# EAGLE design pepper-rev2b (EAGLE 9.4.2)
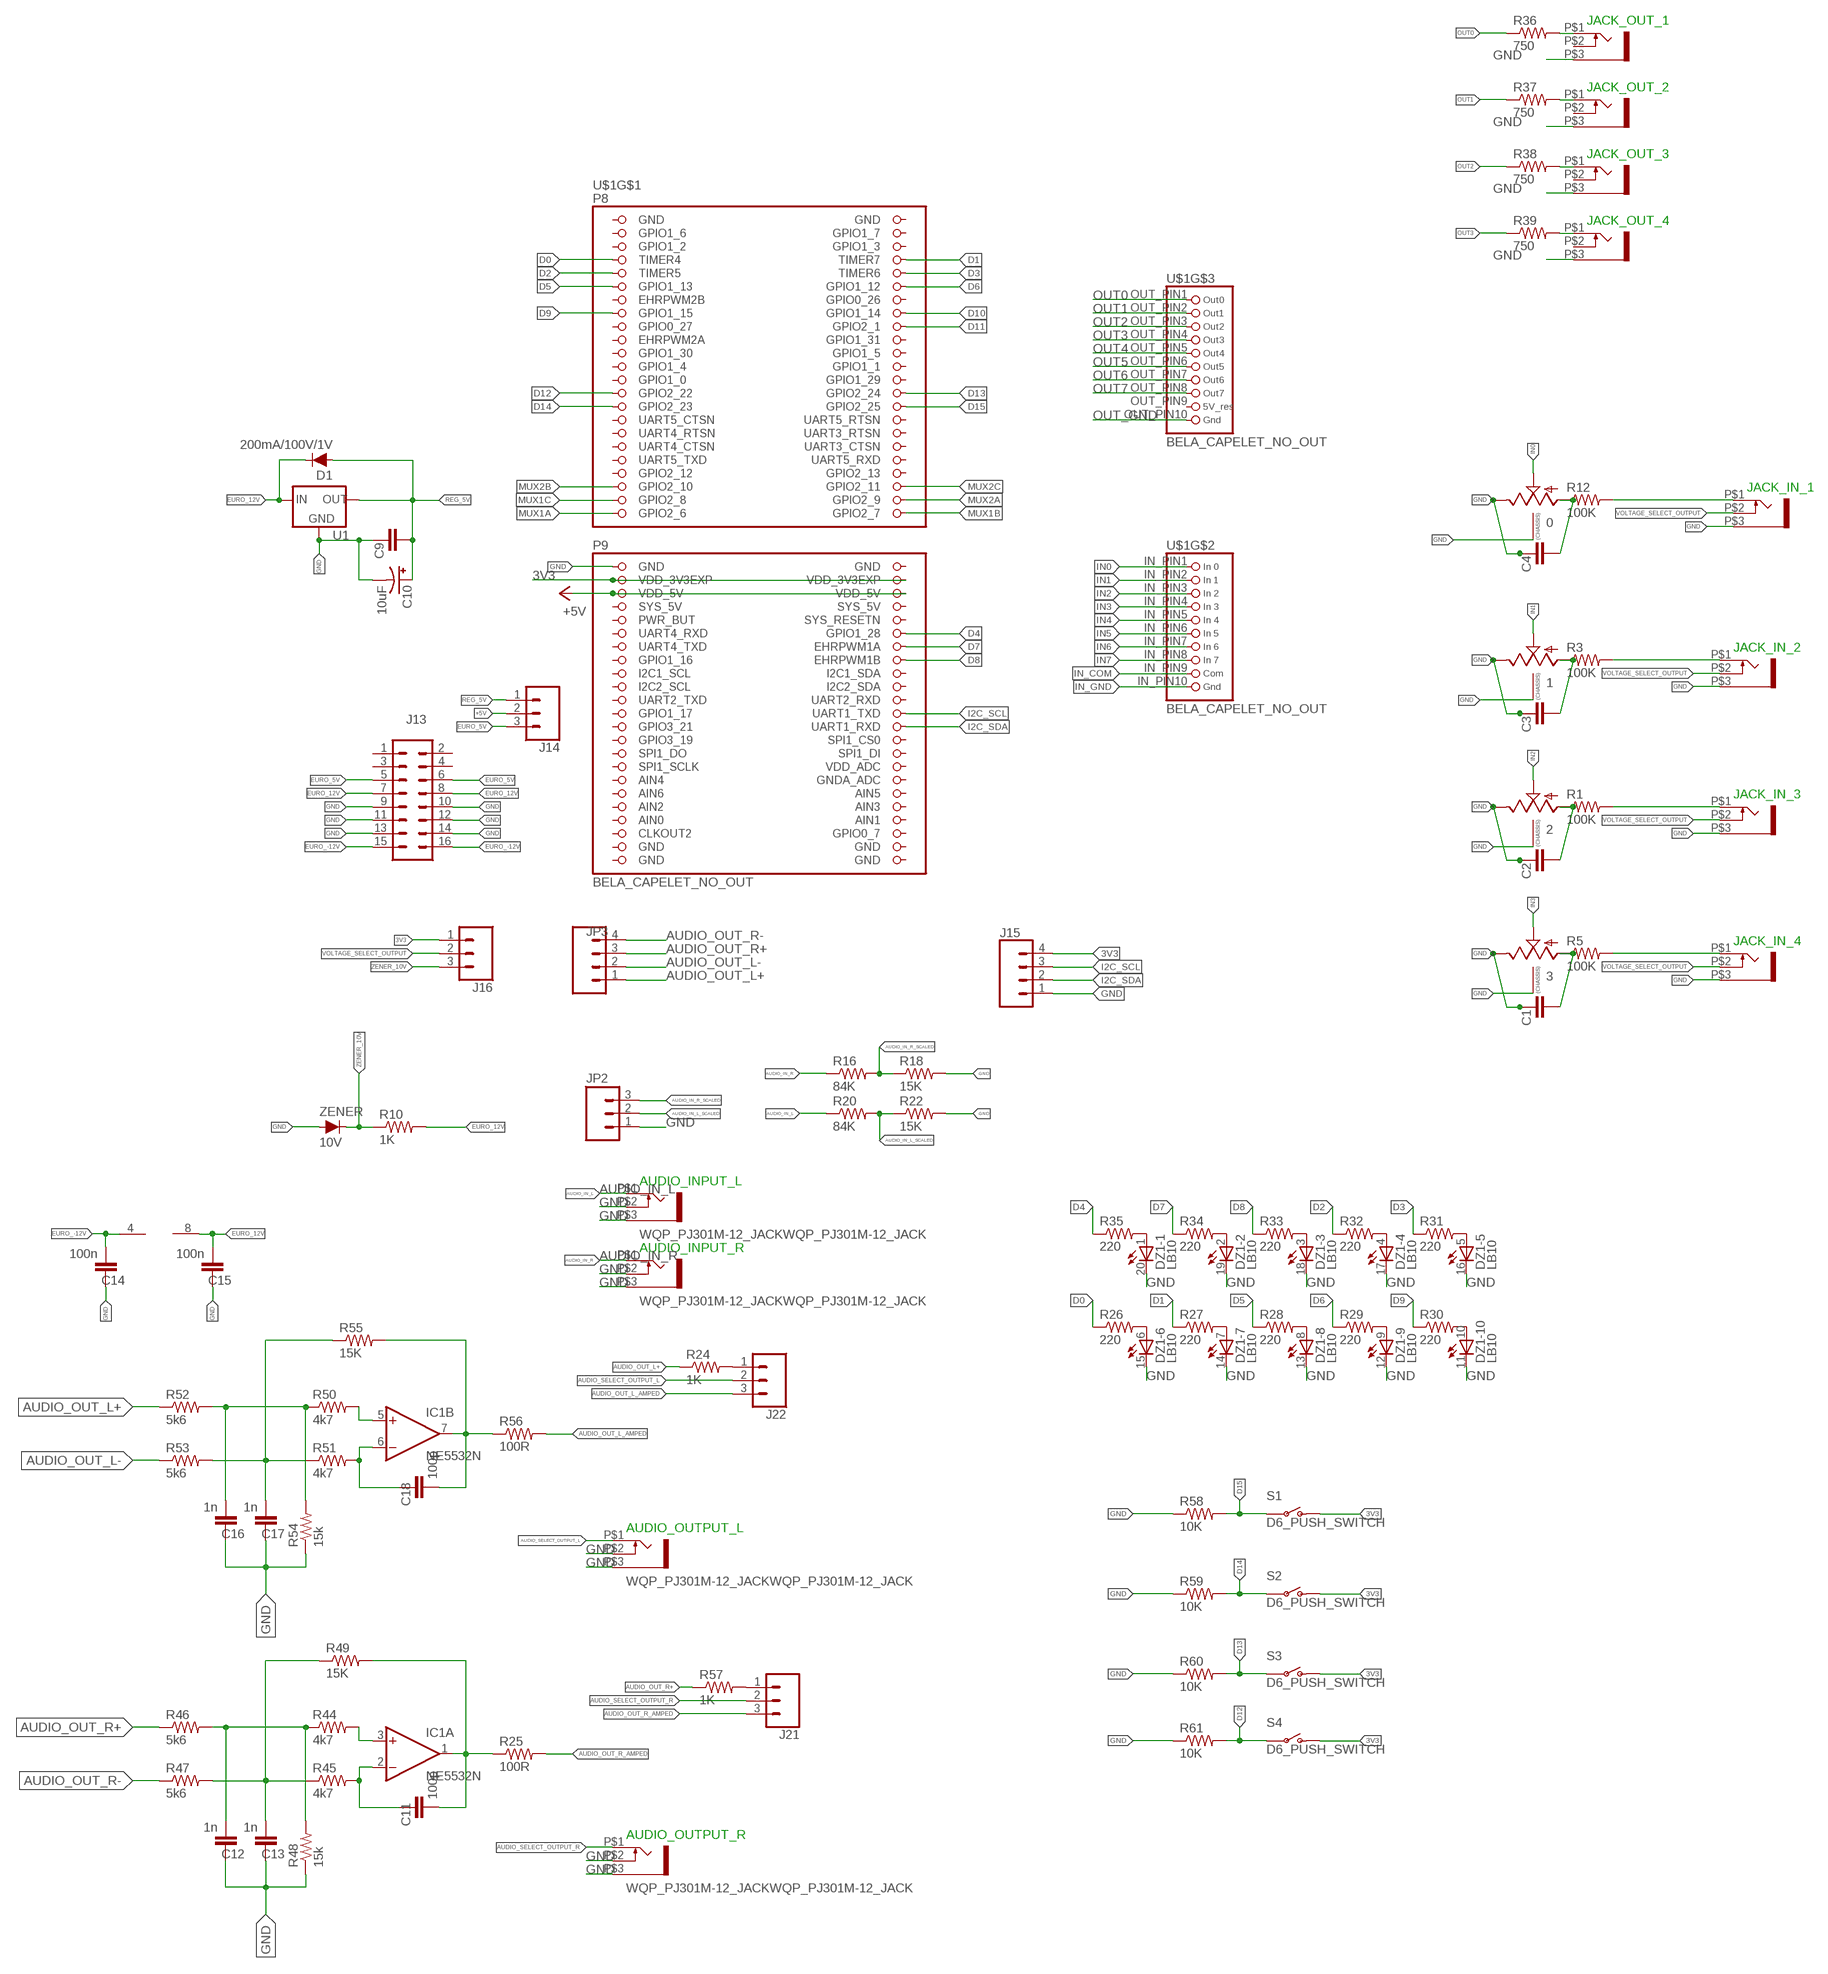
[diagram p0: schematic, sheet 1, part 1 of 2]
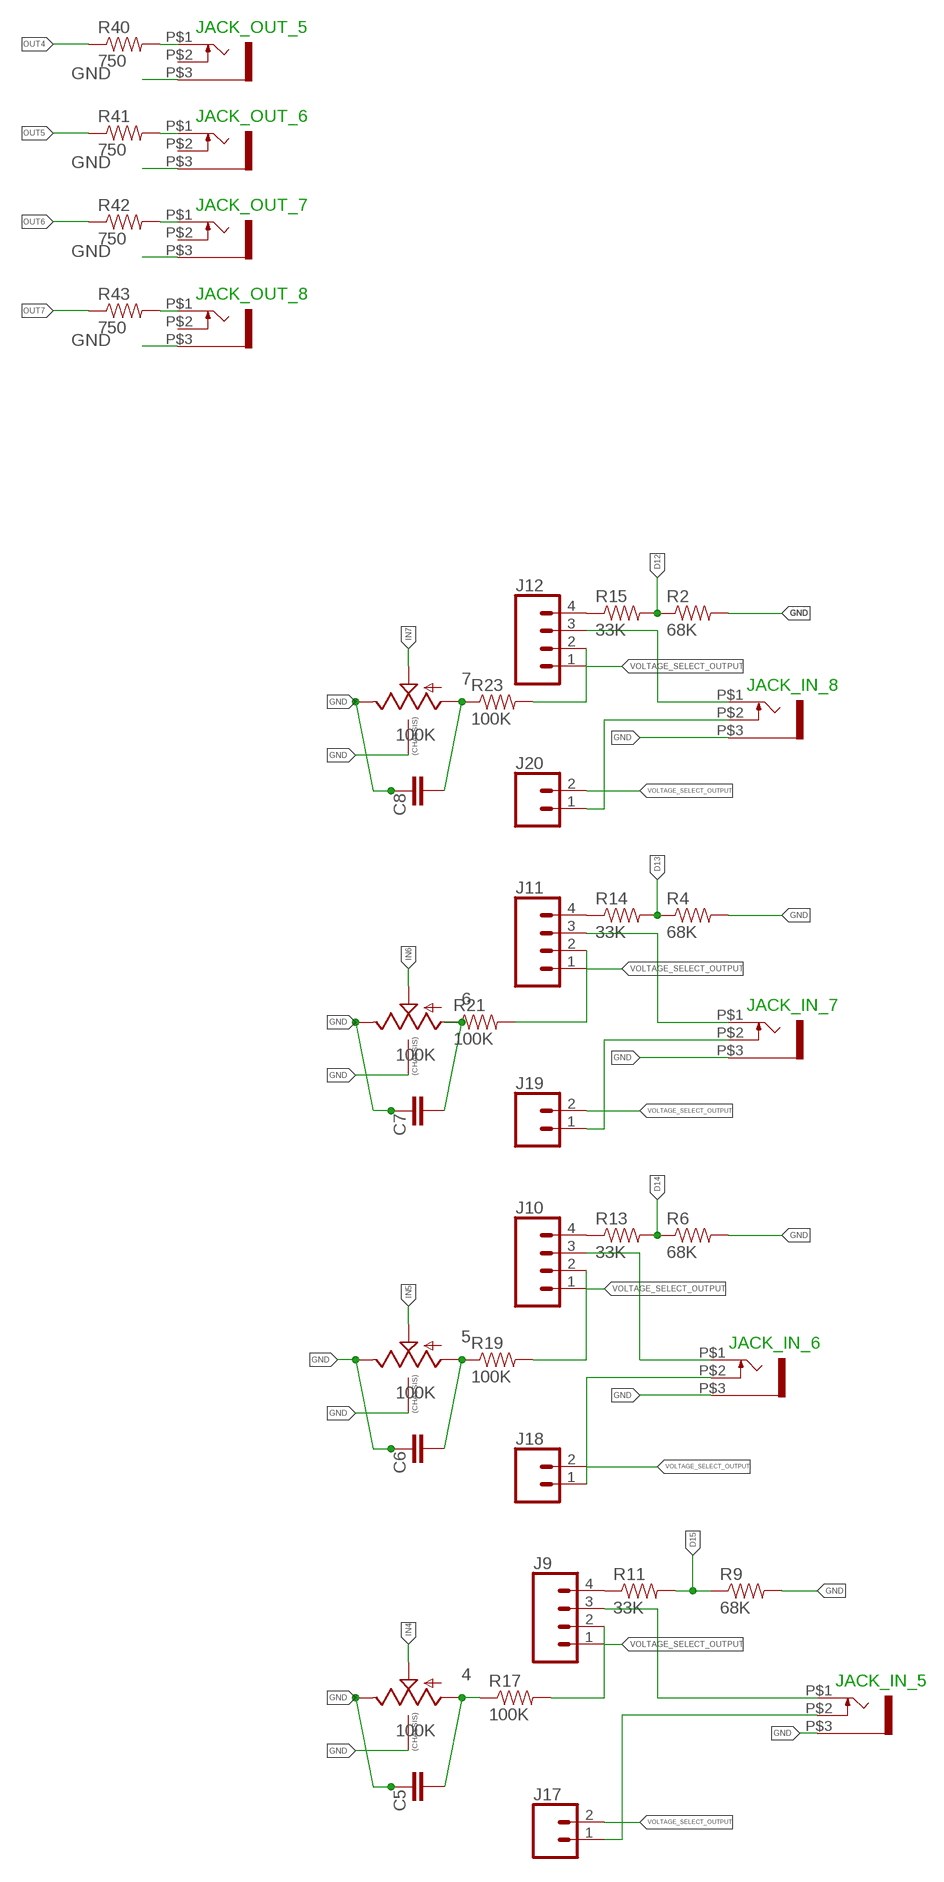
[diagram p1: schematic, sheet 1, part 2 of 2]

## Parts
0  9MM_SNAP-IN_POT_CHASSIS  [9MM_SNAP-IN_POT]
1  9MM_SNAP-IN_POT_CHASSIS  [9MM_SNAP-IN_POT]
2  9MM_SNAP-IN_POT_CHASSIS  [9MM_SNAP-IN_POT]
3  9MM_SNAP-IN_POT_CHASSIS  [9MM_SNAP-IN_POT]
4  100K  9MM_SNAP-IN_POT_CHASSIS  [9MM_SNAP-IN_POT]
5  100K  9MM_SNAP-IN_POT_CHASSIS  [9MM_SNAP-IN_POT]
6  100K  9MM_SNAP-IN_POT_CHASSIS  [9MM_SNAP-IN_POT]
7  100K  9MM_SNAP-IN_POT_CHASSIS  [9MM_SNAP-IN_POT]
AUDIO_INPUT_L  WQP_PJ301M-12_JACKWQP_PJ301M-12_JACK  [JACK-3.5]
AUDIO_INPUT_R  WQP_PJ301M-12_JACKWQP_PJ301M-12_JACK  [JACK-3.5]
AUDIO_OUTPUT_L  WQP_PJ301M-12_JACKWQP_PJ301M-12_JACK  [JACK-3.5]
AUDIO_OUTPUT_R  WQP_PJ301M-12_JACKWQP_PJ301M-12_JACK  [JACK-3.5]
C1  CAPPTH  [CAP-PTH-SMALL]
C2  CAPPTH  [CAP-PTH-SMALL]
C3  CAPPTH  [CAP-PTH-SMALL]
C4  CAPPTH  [CAP-PTH-SMALL]
C5  CAPPTH  [CAP-PTH-SMALL]
C6  CAPPTH  [CAP-PTH-SMALL]
C7  CAPPTH  [CAP-PTH-SMALL]
C8  CAPPTH  [CAP-PTH-SMALL]
C9  CAPPTH  [CAP-PTH-SMALL]
C10  10uF  10UF-POLAR-RADIAL-2.5MM-25V-20%  [CPOL-RADIAL-2.5MM-5MM]
C11  100p  CAPPTH  [CAP-PTH-SMALL]
C12  1n  CAPPTH  [CAP-PTH-SMALL]
C13  1n  CAPPTH  [CAP-PTH-SMALL]
C14  100n  CAPPTH  [CAP-PTH-SMALL]
C15  100n  CAPPTH  [CAP-PTH-SMALL]
C16  1n  CAPPTH  [CAP-PTH-SMALL]
C17  1n  CAPPTH  [CAP-PTH-SMALL]
C18  100p  CAPPTH  [CAP-PTH-SMALL]
D1  200mA/100V/1V  DIODE-1N4148  [DIODE-1N4148]
DZ1  LB10  [LB10]
IC1  NE5532N  [DIL08]
J9  CONN_04PTH  [1X04]
J10  CONN_04PTH  [1X04]
J11  CONN_04PTH  [1X04]
J12  CONN_04PTH  [1X04]
J13  2X6 FEMALE  CONN_08X2  [2X8]
J14  CONN_03  [1X03]
J15  CONN_04PTH  [1X04]
J16  CONN_03  [1X03]
J17  CONN_02  [1X02]
J18  CONN_02  [1X02]
J19  CONN_02  [1X02]
J20  CONN_02  [1X02]
J21  CONN_03  [1X03]
J22  CONN_03  [1X03]
JACK_IN_1  WQP_PJ301M-12_JACKWQP_PJ301M-12_JACK  [JACK-3.5]
JACK_IN_2  WQP_PJ301M-12_JACKWQP_PJ301M-12_JACK  [JACK-3.5]
JACK_IN_3  WQP_PJ301M-12_JACKWQP_PJ301M-12_JACK  [JACK-3.5]
JACK_IN_4  WQP_PJ301M-12_JACKWQP_PJ301M-12_JACK  [JACK-3.5]
JACK_IN_5  WQP_PJ301M-12_JACKWQP_PJ301M-12_JACK  [JACK-3.5]
JACK_IN_6  WQP_PJ301M-12_JACKWQP_PJ301M-12_JACK  [JACK-3.5]
JACK_IN_7  WQP_PJ301M-12_JACKWQP_PJ301M-12_JACK  [JACK-3.5]
JACK_IN_8  WQP_PJ301M-12_JACKWQP_PJ301M-12_JACK  [JACK-3.5]
JACK_OUT_1  WQP_PJ301M-12_JACKWQP_PJ301M-12_JACK  [JACK-3.5]
JACK_OUT_2  WQP_PJ301M-12_JACKWQP_PJ301M-12_JACK  [JACK-3.5]
JACK_OUT_3  WQP_PJ301M-12_JACKWQP_PJ301M-12_JACK  [JACK-3.5]
JACK_OUT_4  WQP_PJ301M-12_JACKWQP_PJ301M-12_JACK  [JACK-3.5]
JACK_OUT_5  WQP_PJ301M-12_JACKWQP_PJ301M-12_JACK  [JACK-3.5]
JACK_OUT_6  WQP_PJ301M-12_JACKWQP_PJ301M-12_JACK  [JACK-3.5]
JACK_OUT_7  WQP_PJ301M-12_JACKWQP_PJ301M-12_JACK  [JACK-3.5]
JACK_OUT_8  WQP_PJ301M-12_JACKWQP_PJ301M-12_JACK  [JACK-3.5]
JP2  M03PTH  [1X03@1]
JP3  CONN_04  [1X04]
R1  100K  RESISTORAXIAL-0.3  [AXIAL-0.3]
R2  68K  RESISTORAXIAL-0.3  [AXIAL-0.3]
R3  100K  RESISTORAXIAL-0.3  [AXIAL-0.3]
R4  68K  RESISTORAXIAL-0.3  [AXIAL-0.3]
R5  100K  RESISTORAXIAL-0.3  [AXIAL-0.3]
R6  68K  RESISTORAXIAL-0.3  [AXIAL-0.3]
R9  68K  RESISTORAXIAL-0.3  [AXIAL-0.3]
R10  1K  RESISTORAXIAL-0.3  [AXIAL-0.3]
R11  33K  RESISTORAXIAL-0.3  [AXIAL-0.3]
R12  100K  RESISTORAXIAL-0.3  [AXIAL-0.3]
R13  33K  RESISTORAXIAL-0.3  [AXIAL-0.3]
R14  33K  RESISTORAXIAL-0.3  [AXIAL-0.3]
R15  33K  RESISTORAXIAL-0.3  [AXIAL-0.3]
R16  84K  RESISTORAXIAL-0.3  [AXIAL-0.3]
R17  100K  RESISTORAXIAL-0.3  [AXIAL-0.3]
R18  15K  RESISTORAXIAL-0.3  [AXIAL-0.3]
R19  100K  RESISTORAXIAL-0.3  [AXIAL-0.3]
R20  84K  RESISTORAXIAL-0.3  [AXIAL-0.3]
R21  100K  RESISTORAXIAL-0.3  [AXIAL-0.3]
R22  15K  RESISTORAXIAL-0.3  [AXIAL-0.3]
R23  100K  RESISTORAXIAL-0.3  [AXIAL-0.3]
R24  1K  RESISTORAXIAL-0.3  [AXIAL-0.3]
R25  100R  RESISTORAXIAL-0.3  [AXIAL-0.3]
R26  220  RESISTORAXIAL-0.3  [AXIAL-0.3]
R27  220  RESISTORAXIAL-0.3  [AXIAL-0.3]
R28  220  RESISTORAXIAL-0.3  [AXIAL-0.3]
R29  220  RESISTORAXIAL-0.3  [AXIAL-0.3]
R30  220  RESISTORAXIAL-0.3  [AXIAL-0.3]
R31  220  RESISTORAXIAL-0.3  [AXIAL-0.3]
R32  220  RESISTORAXIAL-0.3  [AXIAL-0.3]
R33  220  RESISTORAXIAL-0.3  [AXIAL-0.3]
R34  220  RESISTORAXIAL-0.3  [AXIAL-0.3]
R35  220  RESISTORAXIAL-0.3  [AXIAL-0.3]
R36  750  RESISTORAXIAL-0.3  [AXIAL-0.3]
R37  750  RESISTORAXIAL-0.3  [AXIAL-0.3]
R38  750  RESISTORAXIAL-0.3  [AXIAL-0.3]
R39  750  RESISTORAXIAL-0.3  [AXIAL-0.3]
R40  750  RESISTORAXIAL-0.3  [AXIAL-0.3]
R41  750  RESISTORAXIAL-0.3  [AXIAL-0.3]
R42  750  RESISTORAXIAL-0.3  [AXIAL-0.3]
R43  750  RESISTORAXIAL-0.3  [AXIAL-0.3]
R44  4k7  RESISTORAXIAL-0.3  [AXIAL-0.3]
R45  4k7  RESISTORAXIAL-0.3  [AXIAL-0.3]
R46  5k6  RESISTORAXIAL-0.3  [AXIAL-0.3]
R47  5k6  RESISTORAXIAL-0.3  [AXIAL-0.3]
R48  15k  RESISTORAXIAL-0.3  [AXIAL-0.3]
R49  15K  RESISTORAXIAL-0.3  [AXIAL-0.3]
R50  4k7  RESISTORAXIAL-0.3  [AXIAL-0.3]
R51  4k7  RESISTORAXIAL-0.3  [AXIAL-0.3]
R52  5k6  RESISTORAXIAL-0.3  [AXIAL-0.3]
R53  5k6  RESISTORAXIAL-0.3  [AXIAL-0.3]
R54  15k  RESISTORAXIAL-0.3  [AXIAL-0.3]
R55  15K  RESISTORAXIAL-0.3  [AXIAL-0.3]
R56  100R  RESISTORAXIAL-0.3  [AXIAL-0.3]
R57  1K  RESISTORAXIAL-0.3  [AXIAL-0.3]
R58  10K  RESISTORAXIAL-0.3  [AXIAL-0.3]
R59  10K  RESISTORAXIAL-0.3  [AXIAL-0.3]
R60  10K  RESISTORAXIAL-0.3  [AXIAL-0.3]
R61  10K  RESISTORAXIAL-0.3  [AXIAL-0.3]
S1  D6_PUSH_SWITCH  [D6_PUSH_SWITCH]
S2  D6_PUSH_SWITCH  [D6_PUSH_SWITCH]
S3  D6_PUSH_SWITCH  [D6_PUSH_SWITCH]
S4  D6_PUSH_SWITCH  [D6_PUSH_SWITCH]
U1  V_REG_78XXSINK  [TO220-IGO]
U$1  BELA_CAPELET_NO_OUT  [BELA_CAPELET_NO_OUTLINE]
ZENER  10V  DIODE-KIT2  [DIODE-1N4001-KIT]

## Nets
1: JACK_IN_3.P$1 R1.P$2
2: JACK_IN_2.P$1 R3.P$2
3: JACK_IN_1.P$1 R12.P$2
3V3: J15.4 J16.1 S1.P$1(O) S1.P$2(O) S2.P$1(O) S2.P$2(O) S3.P$1(O) S3.P$2(O) S4.P$1(O) S4.P$2(O) U$1.49(VDD_3V3EXP) U$1.50(VDD_3V3EXP)
4: JACK_IN_4.P$1 R5.P$2
+5V: J14.2 U$1.51(VDD_5V) U$1.52(VDD_5V)
AUDIO_IN_L: AUDIO_INPUT_L.P$1 R20.P$1
AUDIO_IN_L_SCALED: JP2.2 R20.P$2 R22.P$1
AUDIO_IN_R: AUDIO_INPUT_R.P$1 R16.P$1
AUDIO_IN_R_SCALED: JP2.3 R16.P$2 R18.P$1
AUDIO_OUT_L+: JP3.1 R24.P$1 R52.P$1
AUDIO_OUT_L-: JP3.2 R53.P$1
AUDIO_OUT_L_AMPED: J22.3 R56.P$2
AUDIO_OUT_R+: JP3.3 R46.P$1 R57.P$1
AUDIO_OUT_R-: JP3.4 R47.P$1
AUDIO_OUT_R_AMPED: J21.3 R25.P$2
AUDIO_SELECT_OUTPUT_L: AUDIO_OUTPUT_L.P$1 J22.2
AUDIO_SELECT_OUTPUT_R: AUDIO_OUTPUT_R.P$1 J21.2
D0: R26.P$1 U$1.7(TIMER4)
D1: R27.P$1 U$1.8(TIMER7)
D2: R32.P$1 U$1.9(TIMER5)
D3: R31.P$1 U$1.10(TIMER6)
D4: R35.P$1 U$1.58(GPIO1_28)
D5: R28.P$1 U$1.11(GPIO1_13)
D6: R29.P$1 U$1.12(GPIO1_12)
D7: R34.P$1 U$1.60(EHRPWM1A)
D8: R33.P$1 U$1.62(EHRPWM1B)
D9: R30.P$1 U$1.15(GPIO1_15)
D10: U$1.16(GPIO1_14)
D11: U$1.18(GPIO2_1)
D12: R2.P$1 R15.P$2 R61.P$2 S4.P$3(P) S4.P$4(P) U$1.27(GPIO2_22)
D13: R4.P$1 R14.P$2 R60.P$2 S3.P$3(P) S3.P$4(P) U$1.28(GPIO2_24)
D14: R6.P$1 R13.P$2 R59.P$2 S2.P$3(P) S2.P$4(P) U$1.29(GPIO2_23)
D15: R9.P$1 R11.P$2 R58.P$2 S1.P$3(P) S1.P$4(P) U$1.30(GPIO2_25)
EURO_5V: J13.5 J13.6 J14.3
EURO_12V: C15.2 D1.C IC1.8(P:V+) J13.7 J13.8 R10.P$2 U1.IN
EURO_-12V: C14.2 IC1.4(P:V-) J13.15 J13.16
GND: 0.3(E) 0.CHASSIS1 0.CHASSIS2 1.3(E) 1.CHASSIS1 1.CHASSIS2 2.3(E) 2.CHASSIS1 2.CHASSIS2 3.3(E) 3.CHASSIS1 3.CHASSIS2 4.3(E) 4.CHASSIS1 4.CHASSIS2 5.3(E) 5.CHASSIS1 5.CHASSIS2 6.3(E) 6.CHASSIS1 6.CHASSIS2 7.3(E) 7.CHASSIS1 7.CHASSIS2 AUDIO_INPUT_L.P$2 AUDIO_INPUT_L.P$3 AUDIO_INPUT_R.P$2 AUDIO_INPUT_R.P$3 AUDIO_OUTPUT_L.P$2 AUDIO_OUTPUT_L.P$3 AUDIO_OUTPUT_R.P$2 AUDIO_OUTPUT_R.P$3 C1.1 C2.1 C3.1 C4.1 C5.1 C6.1 C7.1 C8.1 C9.1 C10.2(-) C12.1 C13.1 C14.1 C15.1 C16.1 C17.1 DZ1.11(-10:C) DZ1.12(-9:C) DZ1.13(-8:C) DZ1.14(-7:C) DZ1.15(-6:C) DZ1.16(-5:C) DZ1.17(-4:C) DZ1.18(-3:C) DZ1.19(-2:C) DZ1.20(-1:C) J13.9 J13.10 J13.11 J13.12 J13.13 J13.14 J15.1 JACK_IN_1.P$3 JACK_IN_2.P$3 JACK_IN_3.P$3 JACK_IN_4.P$3 JACK_IN_5.P$3 JACK_IN_6.P$3 JACK_IN_7.P$3 JACK_IN_8.P$3 JACK_OUT_1.P$3 JACK_OUT_2.P$3 JACK_OUT_3.P$3 JACK_OUT_4.P$3 JACK_OUT_5.P$3 JACK_OUT_6.P$3 JACK_OUT_7.P$3 JACK_OUT_8.P$3 JP2.1 R2.P$2 R4.P$2 R6.P$2 R9.P$2 R18.P$2 R22.P$2 R48.P$1 R54.P$1 R58.P$1 R59.P$1 R60.P$1 R61.P$1 U1.GND U$1.47(GND) ZENER.A
I2C_SCL: J15.3 U$1.70(UART1_TXD)
I2C_SDA: J15.2 U$1.72(UART1_RXD)
IN0: 0.2(S) U$1.IN_PIN1
IN1: 1.2(S) U$1.IN_PIN2
IN2: 2.2(S) U$1.IN_PIN3
IN3: 3.2(S) U$1.IN_PIN4
IN4: 4.2(S) U$1.IN_PIN5
IN5: 5.2(S) U$1.IN_PIN6
IN6: 6.2(S) U$1.IN_PIN7
IN7: 7.2(S) U$1.IN_PIN8
IN_COM: U$1.IN_PIN9
IN_GND: U$1.IN_PIN10
MUX1A: U$1.45(GPIO2_6)
MUX1B: U$1.46(GPIO2_7)
MUX1C: U$1.43(GPIO2_8)
MUX2A: U$1.44(GPIO2_9)
MUX2B: U$1.41(GPIO2_10)
MUX2C: U$1.42(GPIO2_11)
N$2: J10.3 JACK_IN_6.P$1
N$3: DZ1.6(-6:A) R26.P$2
N$4: DZ1.7(-7:A) R27.P$2
N$5: DZ1.8(-8:A) R28.P$2
N$6: DZ1.9(-9:A) R29.P$2
N$7: DZ1.10(-10:A) R30.P$2
N$8: DZ1.5(-5:A) R31.P$2
N$9: DZ1.4(-4:A) R32.P$2
N$10: DZ1.3(-3:A) R33.P$2
N$11: DZ1.2(-2:A) R34.P$2
N$12: DZ1.1(-1:A) R35.P$2
N$13: 1.1(A) C3.2 R3.P$1
N$14: J12.2 R23.P$2
N$15: J11.3 JACK_IN_7.P$1
N$16: 6.1(A) C7.2 R21.P$1
N$17: J9.2 R17.P$2
N$18: 5.1(A) C6.2 R19.P$1
N$19: J9.3 JACK_IN_5.P$1
N$20: J12.3 JACK_IN_8.P$1
N$21: 4.1(A) C5.2 R17.P$1
N$22: J10.4 R13.P$1
N$23: J12.4 R15.P$1
N$24: J9.4 R11.P$1
N$25: J10.2 R19.P$2
N$26: J11.2 R21.P$2
N$27: J11.4 R14.P$1
N$29: J22.1 R24.P$2
N$30: J17.1 JACK_IN_5.P$2
N$31: JACK_OUT_1.P$1 R36.P$2
N$32: J19.1 JACK_IN_7.P$2
N$33: J18.1 JACK_IN_6.P$2
N$34: J20.1 JACK_IN_8.P$2
N$35: JACK_OUT_2.P$1 R37.P$2
N$36: JACK_OUT_3.P$1 R38.P$2
N$37: JACK_OUT_4.P$1 R39.P$2
N$38: JACK_OUT_5.P$1 R40.P$2
N$39: JACK_OUT_6.P$1 R41.P$2
N$40: JACK_OUT_7.P$1 R42.P$2
N$41: JACK_OUT_8.P$1 R43.P$2
N$42: IC1.3(A:+IN) R44.P$2
N$43: C11.1 IC1.2(A:-IN) R45.P$2
N$44: C11.2 IC1.1(A:OUT) R25.P$1 R49.P$2
N$45: C18.1 IC1.6(B:-IN) R51.P$2
N$46: C13.2 R45.P$1 R47.P$2 R49.P$1
N$47: C12.2 R44.P$1 R46.P$2 R48.P$2
N$48: C16.2 R50.P$1 R52.P$2 R54.P$2
N$50: C18.2 IC1.7(B:OUT) R55.P$2 R56.P$1
N$51: J21.1 R57.P$2
N$52: C17.2 R51.P$1 R53.P$2 R55.P$1
N$54: IC1.5(B:+IN) R50.P$2
OUT0: R36.P$1 U$1.OUT_PIN1
OUT1: R37.P$1 U$1.OUT_PIN2
OUT2: R38.P$1 U$1.OUT_PIN3
OUT3: R39.P$1 U$1.OUT_PIN4
OUT4: R40.P$1 U$1.OUT_PIN5
OUT5: R41.P$1 U$1.OUT_PIN6
OUT6: R42.P$1 U$1.OUT_PIN7
OUT7: R43.P$1 U$1.OUT_PIN8
OUT_GND: U$1.OUT_PIN10
POT_IN1: 0.1(A) C4.2 R12.P$1
POT_IN3: 2.1(A) C2.2 R1.P$1
POT_IN4: 3.1(A) C1.2 R5.P$1
POT_IN8: 7.1(A) C8.2 R23.P$1
REG_5V: C9.2 C10.1(+) D1.A J14.1 U1.OUT
VOLTAGE_SELECT_OUTPUT: J9.1 J10.1 J11.1 J12.1 J16.2 J17.2 J18.2 J19.2 J20.2 JACK_IN_1.P$2 JACK_IN_2.P$2 JACK_IN_3.P$2 JACK_IN_4.P$2
ZENER_10V: J16.3 R10.P$1 ZENER.C
Unconnected: J13.1 J13.2 J13.3 J13.4 JACK_OUT_1.P$2 JACK_OUT_2.P$2 JACK_OUT_3.P$2 JACK_OUT_4.P$2 JACK_OUT_5.P$2 JACK_OUT_6.P$2 JACK_OUT_7.P$2 JACK_OUT_8.P$2 U$1.3(GPIO1_6) U$1.4(GPIO1_7) U$1.5(GPIO1_2) U$1.6(GPIO1_3) U$1.13(EHRPWM2B) U$1.14(GPIO0_26) U$1.17(GPIO0_27) U$1.19(EHRPWM2A) U$1.20(GPIO1_31) U$1.21(GPIO1_30) U$1.22(GPIO1_5) U$1.23(GPIO1_4) U$1.24(GPIO1_1) U$1.25(GPIO1_0) U$1.26(GPIO1_29) U$1.31(UART5_CTSN) U$1.32(UART5_RTSN) U$1.33(UART4_RTSN) U$1.34(UART3_RTSN) U$1.35(UART4_CTSN) U$1.36(UART3_CTSN) U$1.37(UART5_TXD) U$1.38(UART5_RXD) U$1.39(GPIO2_12) U$1.40(GPIO2_13) U$1.54(SYS_5V) U$1.55(PWR_BUT) U$1.56(SYS_RESETN) U$1.57(UART4_RXD) U$1.59(UART4_TXD) U$1.61(GPIO1_16) U$1.63(I2C1_SCL) U$1.64(I2C1_SDA) U$1.65(I2C2_SCL) U$1.66(I2C2_SDA) U$1.67(UART2_TXD) U$1.68(UART2_RXD) U$1.69(GPIO1_17) U$1.71(GPIO3_21) U$1.73(GPIO3_19) U$1.74(SPI1_CS0) U$1.75(SPI1_DO) U$1.76(SPI1_DI) U$1.77(SPI1_SCLK) U$1.78(VDD_ADC) U$1.79(AIN4) U$1.80(GNDA_ADC) U$1.81(AIN6) U$1.82(AIN5) U$1.83(AIN2) U$1.84(AIN3) U$1.86(AIN1) U$1.87(CLKOUT2) U$1.88(GPIO0_7) U$1.OUT_PIN9

## Power pins joined to a net without a drawn wire
AIN0: U$1.85(AIN0)
GND: U$1.1(GND) U$1.2(GND) U$1.48(GND) U$1.89(GND) U$1.90(GND) U$1.91(GND) U$1.92(GND)
SYS_5V: U$1.53(SYS_5V)

## Library data of the parts
0 1-7 = MusicThingModular:9MM_SNAP-IN_POT_CHASSIS: 9mm vertical snap-in pot, Alpha / Panasonic style, with a connection to the metal chassis for grounding
AUDIO_INPUT_L AUDIO_INPUT_R AUDIO_OUTPUT_L AUDIO_OUTPUT_R JACK_IN_1-JACK_IN_8 JACK_OUT_1-JACK_OUT_8 = thonkiconn_eagle_v5:WQP_PJ301M-12_JACK: 3.5mm Vertical Jack from Thonk.co.uk
C1-C9 C11-C18 = SparkFun-Capacitors:CAP: Capacitor Standard 0603 ceramic capacitor, and 0.1" leaded capacitor.
C10 = SparkFun-Capacitors:10UF-POLAR: 10.0µF polarized capacitors A capacitor is a passive two-terminal electrical component used to store electrical energy temporarily in an electric field.; PROD_ID: CAP-08440
D1 = SparkFun-DiscreteSemi:DIODE: Diode These are standard reverse protection diodes and small signal diodes. SparkFun Products: SparkFun SparkPunk Sound Kit <https://www.sparkfun.com/products/11177> SparkFun ESP8266 Thing <https://www.sparkfun.com/products/13231>; PROD_ID: DIO-08378
DZ1 = led:LB10: LED BLOCK 10-LED bar graph, DIL, Siemens
IC1 = linear:NE5532: AUDIO AMPLIFIER
J9-J12 J15 JP3 = SparkFun-Connectors:CONN_04: Multi connection point. Often used as Generic Header-pin footprint for 0.1 inch spaced/style header connections On any of the 0.1 inch spaced packages, you can populate with these: Break Away Headers - Straight <https://www.sparkfun.com/products/116> (PRT-00116) Break Away Male Headers - Right Angle <https://www.sparkfun.com/products/553> (PRT-00553) Female Headers <https://www.sparkfun.com/products/115> (PRT-00115) Break Away Headers - Machine Pin <https://www.sparkfun.com/products/117> (PRT-00117) Break Away Female Headers - Swiss Machine Pin <https://www.sparkfun.com/products/743> (PRT-00743) For SCREWTERMINALS and SPRING TERMINALS visit here: Screw Terimnals on SparkFun.com <https://www.sparkfun.com/search/results?term=Screw+Terminals> (5mm/3.5mm/2.54mm spacing) This device is also useful as a general connection point to wire up your design to another part of your project. Our various solder wires solder well into these plated through hole pads. Hook-Up Wire - Assortment (Stranded, 22 AWG) <https://www.sparkfun.com/products/11375> (PRT-11375) Hook-Up Wire - Assortment (Solid Core, 22 AWG) <https://www.sparkfun.com/products/11367> (PRT-11367) View the entire wire category on our website here <https://www.sparkfun.com/categories/141> Special notes: Molex polarized connector foot print use with SKU : PRT-08231 with associated crimp pins and housings. 1MM SMD Version SKU: PRT-10208; PROD_ID: CONN-09696
J13 = SparkFun-Connectors:CONN_08X2: Multi connection point. Often used as Generic Header-pin footprint for 0.1 inch spaced/style header connections You can populate with any combo of single row headers, but if you'd like an exact match, check this: Header - 2x8 (Male, 0.1") <https://www.sparkfun.com/products/13156> (PRT-13156) On any of the 0.1 inch spaced packages, you can populate with these: Break Away Headers - Straight <https://www.sparkfun.com/products/116> (PRT-00116) Break Away Male Headers - Right Angle <https://www.sparkfun.com/products/553> (PRT-00553) Female Headers <https://www.sparkfun.com/products/115> (PRT-00115) Break Away Headers - Machine Pin <https://www.sparkfun.com/products/117> (PRT-00117) Break Away Female Headers - Swiss Machine Pin <https://www.sparkfun.com/products/743> (PRT-00743)
J14 J16 J21 J22 = SparkFun-Connectors:CONN_03: Multi connection point. Often used as Generic Header-pin footprint for 0.1 inch spaced/style header connections On any of the 0.1 inch spaced packages, you can populate with these: Break Away Headers - Straight <https://www.sparkfun.com/products/116> (PRT-00116) Break Away Male Headers - Right Angle <https://www.sparkfun.com/products/553> (PRT-00553) Female Headers <https://www.sparkfun.com/products/115> (PRT-00115) Break Away Headers - Machine Pin <https://www.sparkfun.com/products/117> (PRT-00117) Break Away Female Headers - Swiss Machine Pin <https://www.sparkfun.com/products/743> (PRT-00743) Stackable Header - 3 Pin (Female, 0.1") <https://www.sparkfun.com/products/13875> (PRT-13875) For SCREWTERMINALS and SPRING TERMINALS visit here: Screw Terimnals on SparkFun.com <https://www.sparkfun.com/search/results?term=Screw+Terminals> (5mm/3.5mm/2.54mm spacing) This device is also useful as a general connection point to wire up your design to another part of your project. Our various solder wires solder well into these plated through hole pads. Hook-Up Wire - Assortment (Stranded, 22 AWG) <https://www.sparkfun.com/products/11375> (PRT-11375) Hook-Up Wire - Assortment (Solid Core, 22 AWG) <https://www.sparkfun.com/products/11367> (PRT-11367) View the entire wire category on our website here <https://www.sparkfun.com/categories/141> Special notes: Molex polarized connector foot print use with SKU : PRT-08232 with associated crimp pins and housings.; PROD_ID: XXX-00000; VALUE: 455-1750-1-ND
J17-J20 = SparkFun-Connectors:CONN_02: Multi connection point. Often used as Generic Header-pin footprint for 0.1 inch spaced/style header connections On any of the 0.1 inch spaced packages, you can populate with these: Break Away Headers - Straight <https://www.sparkfun.com/products/116> (PRT-00116) Break Away Male Headers - Right Angle <https://www.sparkfun.com/products/553> (PRT-00553) Female Headers <https://www.sparkfun.com/products/115> (PRT-00115) Break Away Headers - Machine Pin <https://www.sparkfun.com/products/117> (PRT-00117) Break Away Female Headers - Swiss Machine Pin <https://www.sparkfun.com/products/743> (PRT-00743) For SCREWTERMINALS and SPRING TERMINALS visit here: Screw Terimnals on SparkFun.com <https://www.sparkfun.com/search/results?term=Screw+Terminals> (5mm/3.5mm/2.54mm spacing) This device is also useful as a general connection point to wire up your design to another part of your project. Our various solder wires solder well into these plated through hole pads. Hook-Up Wire - Assortment (Stranded, 22 AWG) <https://www.sparkfun.com/products/11375> (PRT-11375) Hook-Up Wire - Assortment (Solid Core, 22 AWG) <https://www.sparkfun.com/products/11367> (PRT-11367) View the entire wire category on our website here <https://www.sparkfun.com/categories/141> Special notes: Molex polarized connector foot print use with: PRT-08233 with associated crimp pins and housings. 2.54_SCREWTERM for use with PRT-10571. 3.5mm Screw Terminal footprints for PRT-08084 5mm Screw Terminal footprints for use with PRT-08432
JP2 = SparkFun-Connectors:M03: Header 3 Standard 3-pin 0.1" header. Use with straight break away headers (SKU : PRT-00116), right angle break away headers (PRT-00553), swiss pins (PRT-00743), machine pins (PRT-00117), and female headers (PRT-00115). Molex polarized connector foot print use with SKU : PRT-08232 with associated crimp pins and housings.
R1-R6 R9-R61 = SparkFun-Resistors:RESISTOR: Generic Resistor Package
S1-S4 = MusicThingModular:D6_PUSH_SWITCH: Push switch
U1 = SparkFun-IC-Power:V_REG_78XX: Voltage Regulator Standard 78xx regulator. IGO (Input Ground Output). Spark Fun Electronics SKU : COM-00107
U$1 = custom:BELA_CAPELET: Should match A3 pinout - but not completely tested
ZENER = SparkFun-DiscreteSemi:DIODE: Diode These are standard reverse protection diodes and small signal diodes. SparkFun Products: SparkFun SparkPunk Sound Kit <https://www.sparkfun.com/products/11177> SparkFun ESP8266 Thing <https://www.sparkfun.com/products/13231>; PROD_ID: DIO-09176; VALUE: 1A/50V/1.1V

## Board
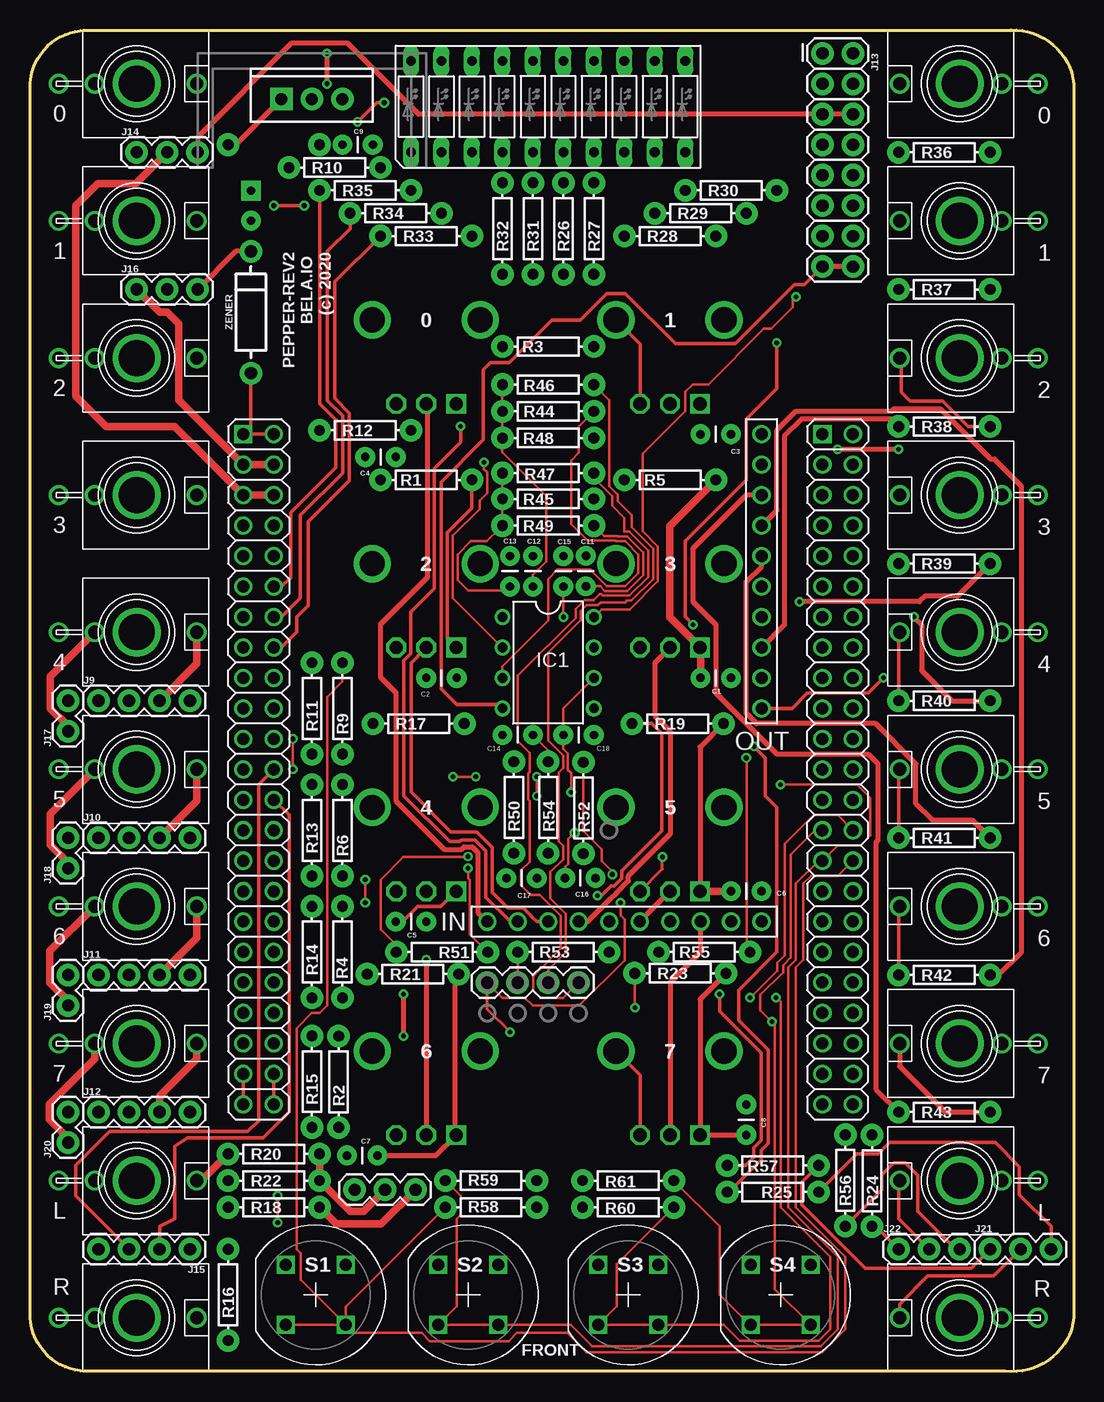
[diagram p2: board, top side]
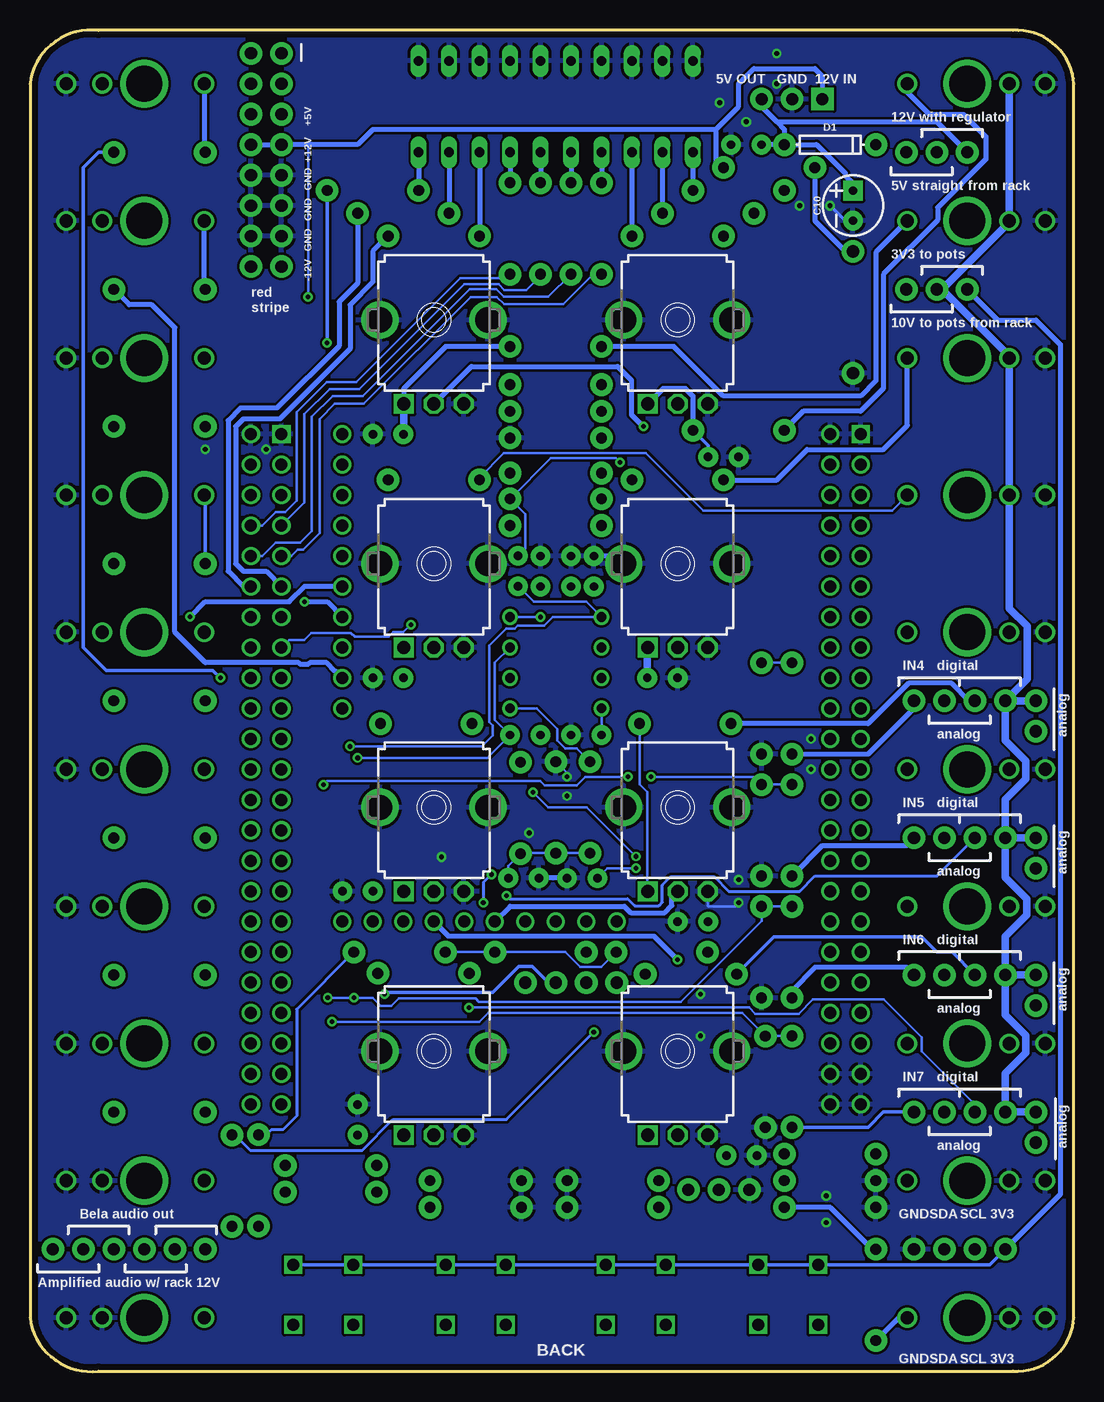
[diagram p3: board, bottom side, seen from below]

Size 87 x 111.83 mm. Coordinates in mm from the lower left corner, seen from the top.
Outline: 0,107.35 arc-90 5.08,111.8 81.28,111.8 arc-90 87,107.35 87,4.48 arc-90 81.28,0.04 5.08,0.04 arc-90 0,4.48 0,107.35
Copper layers (1*16): Top 0.035mm / dielectric 1.5mm / Bottom 0.035mm
Design rules "default *": minimum track width 8mil, minimum drill 15mil, track to track 8mil, track to pad 8mil, pad to pad 8mil, via to via 8mil, smd to smd 0mil, copper to edge 20mil, drill to drill 8mil, minimum pad ring 10mil, minimum via ring 8mil, stop-mask expansion 4mil, vias tented up to drill 20mil, thermal gap 10mil

### Footprints (pad centres in the part's own frame; a part is rotated, then mirrored left to right if it is on the bottom)
9MM_SNAP-IN_POT = drill 1.1 square: 1 -2.5,-7 | drill 1.1 octagon: 2 0,-7; 3 2.5,-7 | drill 2.1 pad 2.794: CHASSIS1 -4.5,0; CHASSIS2 4.5,0
JACK-3.5 = drill 1.1: P$1 0,5; P$2 0,-3.5; P$3 0,-6.5 | drill 3: P$4 0,0
CAP-PTH-SMALL = drill 0.7 pad 1.651: 1 0,0; 2 2.54,0
CPOL-RADIAL-2.5MM-5MM = drill 0.7 pad 1.651 square: 1 1.25,0 | drill 0.7 pad 1.651: 2 -1.25,0
DIODE-1N4148 = drill 0.9 pad 1.88: A -3.81,0; C 3.81,0
LB10 = drill 0.813 long: 1 -11.43,-3.81; 2 -8.89,-3.81; 3 -6.35,-3.81; 4 -3.81,-3.81; 5 -1.27,-3.81; 6 1.27,-3.81; 7 3.81,-3.81; 8 6.35,-3.81; 9 8.89,-3.81; 10 11.43,-3.81; 11 11.43,3.81; 12 8.89,3.81; 13 6.35,3.81; 14 3.81,3.81; 15 1.27,3.81; 16 -1.27,3.81; 17 -3.81,3.81; 18 -6.35,3.81; 19 -8.89,3.81; 20 -11.43,3.81
DIL08 = drill 0.813 pad 1.27: 1 -3.81,-3.81; 2 -1.27,-3.81; 3 1.27,-3.81; 4 3.81,-3.81; 5 3.81,3.81; 6 1.27,3.81; 7 -1.27,3.81; 8 -3.81,3.81
1X04 = drill 1.016 pad 1.88: 1 0,0; 2 2.54,0; 3 5.08,0; 4 7.62,0
2X8 = drill 1.016 pad 1.88: 1 0,0; 2 0,2.54; 3 2.54,0; 4 2.54,2.54; 5 5.08,0; 6 5.08,2.54; 7 7.62,0; 8 7.62,2.54; 9 10.16,0; 10 10.16,2.54; 11 12.7,0; 12 12.7,2.54; 13 15.24,0; 14 15.24,2.54; 15 17.78,0; 16 17.78,2.54
1X03 = drill 1.016 pad 1.88: 1 0,0; 2 2.54,0; 3 5.08,0
1X02 = drill 1.016 pad 1.88: 1 0,0; 2 2.54,0
1X03@1 = drill 1.016 pad 1.88: 1 0,0; 2 2.54,0; 3 5.08,0
AXIAL-0.3 = drill 0.9 pad 1.88: P$1 -3.81,0; P$2 3.81,0
D6_PUSH_SWITCH = drill 1 square: P$1 -2.5,2.5; P$2 2.5,2.5; P$3 2.5,-2.5; P$4 -2.5,-2.5
TO220-IGO = drill 1 pad 1.88: GND 0,0; OUT 2.54,0 | drill 1 pad 1.88 square: IN -2.54,0
BELA_CAPELET_NO_OUTLINE = drill 1 square: 1 -20.32,-31.75; 47 27.94,-31.75 | drill 1: 2 -22.86,-31.75; 3 -20.32,-29.21; 4 -22.86,-29.21; 5 -20.32,-26.67; 6 -22.86,-26.67; 7 -20.32,-24.13; 8 -22.86,-24.13; 9 -20.32,-21.59; 10 -22.86,-21.59; 11 -20.32,-19.05; 12 -22.86,-19.05; 13 -20.32,-16.51; 14 -22.86,-16.51; 15 -20.32,-13.97; 16 -22.86,-13.97; 17 -20.32,-11.43; 18 -22.86,-11.43; 19 -20.32,-8.89; 20 -22.86,-8.89; 21 -20.32,-6.35; 22 -22.86,-6.35; 23 -20.32,-3.81; 24 -22.86,-3.81; 25 -20.32,-1.27; 26 -22.86,-1.27; 27 -20.32,1.27; 28 -22.86,1.27; 29 -20.32,3.81; 30 -22.86,3.81; 31 -20.32,6.35; 32 -22.86,6.35; 33 -20.32,8.89; 34 -22.86,8.89; 35 -20.32,11.43; 36 -22.86,11.43; 37 -20.32,13.97; 38 -22.86,13.97; 39 -20.32,16.51; 40 -22.86,16.51; 41 -20.32,19.05; 42 -22.86,19.05; 43 -20.32,21.59; 44 -22.86,21.59; 45 -20.32,24.13; 46 -22.86,24.13; 48 25.4,-31.75; 49 27.94,-29.21; 50 25.4,-29.21; 51 27.94,-26.67; 52 25.4,-26.67; 53 27.94,-24.13; 54 25.4,-24.13; 55 27.94,-21.59; 56 25.4,-21.59; 57 27.94,-19.05; 58 25.4,-19.05; 59 27.94,-16.51; 60 25.4,-16.51; 61 27.94,-13.97; 62 25.4,-13.97; 63 27.94,-11.43; 64 25.4,-11.43; 65 27.94,-8.89; 66 25.4,-8.89; 67 27.94,-6.35; 68 25.4,-6.35; 69 27.94,-3.81; 70 25.4,-3.81; 71 27.94,-1.27; 72 25.4,-1.27; 73 27.94,1.27; 74 25.4,1.27; 75 27.94,3.81; 76 25.4,3.81; 77 27.94,6.35; 78 25.4,6.35; 79 27.94,8.89; 80 25.4,8.89; 81 27.94,11.43; 82 25.4,11.43; 83 27.94,13.97; 84 25.4,13.97; 85 27.94,16.51; 86 25.4,16.51; 87 27.94,19.05; 88 25.4,19.05; 89 27.94,21.59; 90 25.4,21.59; 91 27.94,24.13; 92 25.4,24.13; IN_PIN1 7.62,8.89; IN_PIN2 5.08,8.89; IN_PIN3 2.54,8.89; IN_PIN4 0,8.89; IN_PIN5 -2.54,8.89; IN_PIN6 -5.08,8.89; IN_PIN7 -7.62,8.89; IN_PIN8 -10.16,8.89; IN_PIN9 -12.7,8.89; IN_PIN10 -15.24,8.89; OUT_PIN1 -15.24,-8.89; OUT_PIN2 -15.24,-11.43; OUT_PIN3 -15.24,-13.97; OUT_PIN4 -15.24,-16.51; OUT_PIN5 -15.24,-19.05; OUT_PIN6 -15.24,-21.59; OUT_PIN7 -15.24,-24.13; OUT_PIN8 -15.24,-26.67; OUT_PIN9 -15.24,-29.21; OUT_PIN10 -15.24,-31.75
DIODE-1N4001-KIT = drill 1.016 pad 1.88: A -5.08,0; C 5.08,0

### Placement (x,y rotation side)
0  33.02,87.67 0 bottom
1  53.34,87.67 0 bottom
2  33.02,67.35 0 bottom
3  53.34,67.35 0 bottom
4  33.02,47.03 0 bottom
5  53.34,47.03 0 bottom
6  33.02,26.71 0 bottom
7  53.34,26.71 0 bottom
AUDIO_INPUT_L  8.89,15.91 270 top
AUDIO_INPUT_R  8.89,4.48 270 top
AUDIO_OUTPUT_L  77.47,15.91 90 top
AUDIO_OUTPUT_R  77.47,4.48 90 top
C1  58.42,57.82 180 top
C2  33.02,57.82 0 top
C3  58.42,78.14 180 top
C4  27.94,76.24 0 top
C5  33.02,37.5 180 top
C6  60.96,40.04 180 top
C7  26.42,18.01 0 top
C8  59.69,22.26 270 top
C9  28.58,102.27 180 top
C10  18.41,97.19 90 bottom
C11  46.32,68 270 top
C12  41.91,67.98 270 top
C13  40.01,67.98 270 top
C14  41.91,53.06 180 top
C15  44.45,67.98 270 top
C16  44.59,41.14 0 top
C17  42.24,41.13 180 top
C18  44.45,53.06 0 top
D1  20.32,102.27 0 bottom
DZ1  43.18,105.45 0 top
IC1  43.18,59.09 270 top
J9  5.71,55.92 0 top
J10  5.71,44.49 0 top
J11  5.71,33.06 0 top
J12  5.71,21.63 0 top
J13  66.04,109.89 270 top
J14  8.89,101.64 0 top
J15  13.34,10.2 180 top
J16  8.89,90.21 0 top
J17  3.18,53.38 90 top
J18  3.18,41.95 90 top
J19  3.18,30.52 90 top
J20  3.18,19.09 90 top
J21  80.01,10.2 0 top
J22  72.39,10.2 0 top
JACK_IN_1  8.89,107.35 270 top
JACK_IN_2  8.89,95.92 270 top
JACK_IN_3  8.89,84.49 270 top
JACK_IN_4  8.89,73.06 270 top
JACK_IN_5  8.89,61.63 270 top
JACK_IN_6  8.89,50.2 270 top
JACK_IN_7  8.89,38.77 270 top
JACK_IN_8  8.89,27.34 270 top
JACK_OUT_1  77.47,107.35 90 top
JACK_OUT_2  77.47,95.92 90 top
JACK_OUT_3  77.47,84.49 90 top
JACK_OUT_4  77.47,73.06 90 top
JACK_OUT_5  77.47,61.63 90 top
JACK_OUT_6  77.47,50.2 90 top
JACK_OUT_7  77.47,38.77 90 top
JACK_OUT_8  77.47,27.34 90 top
JP2  27.05,15.15 0 top
JP3  38.1,32.42 0 top
R1  33.02,74.33 180 top
R2  25.72,24.16 270 top
R3  43.18,85.44 180 top
R4  26.04,34.96 270 top
R5  53.34,74.33 180 top
R6  26.04,45.12 270 top
R9  26.04,55.28 270 top
R10  25.4,100.37 0 top
R11  23.5,55.28 90 top
R12  27.94,78.46 180 top
R13  23.5,45.12 90 top
R14  23.5,34.96 90 top
R15  23.5,24.17 90 top
R16  16.51,6.39 90 top
R17  32.38,54.01 180 top
R18  20.32,13.69 180 top
R19  53.98,54.01 180 top
R20  20.32,18.13 0 top
R21  31.91,33.13 180 top
R22  20.32,15.91 180 top
R23  54.2,33.2 180 top
R24  70.17,15.91 270 top
R25  61.91,14.96 0 top
R26  44.45,95.29 90 top
R27  46.99,95.29 90 top
R28  53.34,94.65 180 top
R29  55.88,96.56 180 top
R30  58.42,98.46 180 top
R31  41.91,95.29 90 top
R32  39.37,95.29 90 top
R33  33.02,94.65 0 top
R34  30.48,96.56 0 top
R35  27.94,98.46 0 top
R36  76.2,101.64 180 top
R37  76.2,90.21 180 top
R38  76.2,78.78 0 top
R39  76.2,67.35 180 top
R40  76.2,55.92 180 top
R41  76.2,44.49 180 top
R42  76.2,33.06 180 top
R43  76.2,21.63 0 top
R44  43.18,80.05 0 top
R45  43.18,72.74 0 top
R46  43.18,82.27 180 top
R47  43.18,74.9 180 top
R48  43.18,77.82 180 top
R49  43.18,70.52 0 top
R50  40.32,47.03 90 top
R51  34.34,34.96 180 top
R52  46.11,46.98 270 top
R53  44.45,34.96 0 top
R54  43.18,47.03 270 top
R55  56.2,34.96 0 top
R56  67.94,15.92 270 top
R57  61.91,17.18 0 top
R58  38.42,13.69 180 top
R59  38.42,15.91 180 top
R60  49.85,13.69 0 top
R61  49.85,15.91 0 top
S1  23.81,6.39 0 top
S2  36.51,6.39 0 top
S3  49.85,6.39 0 top
S4  62.55,6.39 0 top
U1  23.5,106.08 0 top
U$1  45.72,46.39 180 top
ZENER  18.41,88.3 90 top

### Tracks (layer width: path | path; a pad name or v marks a point on that pad's centre or on a via)
1
  Bottom 0.406: R1.P$2 24.77,74.33 22.23,76.87 15.88,76.87 13.89,78.86 JACK_IN_3.P$1
2
  Bottom 0.406: JACK_IN_2.P$1 16.51,93.3 16.51,82.59 17.78,81.32 29.21,81.32 33.34,85.44 R3.P$2
3
  Bottom 0.406: JACK_IN_1.P$1 13.89,106.64 12.07,104.81 9.21,104.81 7.34,102.95 7.34,101.04 11.36,97.03 11.36,96 15.88,91.48 15.88,81.95 17.78,80.05 22.54,80.05 R12.P$2
3V3
  Top 0.61: U$1.50 U$1.49 12.38,81 12.38,87.35 11.43,88.3 10.8,88.3 J16.1
  Bottom 0.305: J15.4 7.02,8.89 S1.P$1 S1.P$2 S2.P$1 S2.P$2 S3.P$1 S3.P$2 S4.P$1 S4.P$2
  Bottom 0.406: J16.1 6.35,87.67 3.18,87.67 1.13,85.62 1.13,14.78 J15.4
4
  Bottom 0.203: R5.P$2 49.53,74.54 47.5,76.57 35.68,76.57 30.91,71.79 15.16,71.79 JACK_IN_4.P$1
+5V
  Top 0.61: U$1.52 U$1.51 12.07,78.78 6.35,78.78 3.81,81.32 3.81,97.19 5.65,99.03 8.82,99.03 J14.2
AUDIO_IN_L
  Top 0.61: AUDIO_INPUT_L.P$1 14.29,15.91 R20.P$1
AUDIO_IN_L_SCALED
  Top 0.61: JP2.2 27.81,13.37 26.67,13.37 R22.P$1 R20.P$2
AUDIO_IN_R
  Bottom 0.406: R16.P$1 14.61,4.48 AUDIO_INPUT_R.P$1
AUDIO_IN_R_SCALED
  Top 0.61: JP2.3 29.27,12.3 25.52,12.3 R18.P$1
  Bottom 0.406: R18.P$1 20.32,13.69 16.83,10.2 R16.P$2
AUDIO_OUT_L+  (via drill 0.4)
  Top 0.203: R52.P$1 46.12,45.04 47.63,43.53 47.63,42.58 48.5,41.71 48.5,41.47 v48.53,41.44 | v49.21,39.09 49.21,38.01 49.54,37.68 49.54,34.27 45.78,30.51 41.88,30.51 41.24,31.15 39.37,31.15 JP3.1
  Top 0.254: v40.01,28.29 38.1,30.2 JP3.1
  Bottom 0.254: v40.01,28.29 47.29,21 56.76,21 59.3,18.46 68.65,18.46 69.92,19.72 R24.P$1 | v48.53,41.44 v48.54,41.44 49.21,40.77 v49.21,39.09
AUDIO_OUT_L-
  Top 0.203: R53.P$1 JP3.2
AUDIO_OUT_L_AMPED
  Top 0.305: R56.P$2 71,15.17 71,16.39 71.99,17.38 72.95,17.38 73.98,16.36 73.98,13.37 77.15,10.2 J22.3
AUDIO_OUT_R+  (via drill 0.38)
  Top 0.203: R46.P$1 48.26,81 48.26,73.83 48.99,73.09 48.99,72.54 50.15,71.39 50.15,70.39 51.92,68.62 51.92,66.07 50.12,64.26 49.74,64.26 49.6,64.12 48.74,64.12 48.73,64.11 47.57,64.11 47.33,63.88 46.38,63.88 45.88,63.38 45.88,62.66 43.18,59.96 43.18,52.6 44.43,51.35 44.43,50.32 44.04,49.94 44.04,48.76 44.07,48.74 44.07,44.2 44.44,43.83 44.44,42.69 43.37,41.63 43.37,39.43 44.66,38.15 44.66,34.95 43.18,33.47 JP3.3
  Top 0.305: v57.47,31.47 57.47,30.03 60.94,26.56 60.94,19.27 60.3,18.64 60.3,17.84 59.64,17.18 R57.P$1
  Bottom 0.305: JP3.3 43.8,32.42 45.14,33.76 46.28,33.76 48.43,31.62 57.32,31.62 v57.47,31.47
AUDIO_OUT_R-
  Top 0.203: R47.P$1 46.99,74.51 48.52,72.98 48.52,72.17 49.53,71.16 49.53,70.04 49.55,70.02 49.95,70.02 51.52,68.45 51.52,66.24 49.95,64.67 47.73,64.67 47.6,64.81 47.5,64.81 46.99,64.3 46.21,64.3 45.46,63.55 45.46,62.83 40.64,58.01 40.64,52.56 41.64,51.56 41.64,49.97 41.53,49.86 41.53,47.69 41.64,47.58 41.64,42.49 40.96,41.81 40.96,40.52 41.74,39.74 42.47,39.74 44.24,37.97 44.24,35.26 41.92,32.95 41.92,31.77 42.54,31.16 44.46,31.16 JP3.4
AUDIO_OUT_R_AMPED
  Top 0.305: R25.P$2 68.9,18.13 70.69,18.13 71.65,19.09 80.43,19.09 82.44,17.07 82.44,14.75 85.09,12.1 J21.3
AUDIO_SELECT_OUTPUT_L
  Top 0.305: J22.2 72.39,12.74 72.39,15.91 AUDIO_OUTPUT_L.P$1
AUDIO_SELECT_OUTPUT_R
  Top 0.305: J21.2 80.33,7.97 74.83,7.97 72.47,5.61 AUDIO_OUTPUT_R.P$1
D0
  Bottom 0.203: U$1.7 64.13,72.43 64.13,79.79 62.03,81.9 59.54,81.9 50.79,90.64 47.95,90.64 47.46,90.16 45.64,90.16 44.45,91.34 R26.P$1
D1
  Bottom 0.203: U$1.8 67.65,70.52 66.51,71.66 65.73,71.66 64.77,72.62 64.77,79.99 62.27,82.48 59.81,82.48 51.14,91.16 47.31,91.16 R27.P$1
D2
  Bottom 0.203: U$1.9 65.23,67.98 64.7,68.51 64.24,68.51 62.87,69.89 62.87,79.41 61.6,80.68 59.17,80.68 50.27,89.58 48.1,89.58 47.49,88.97 42.55,88.97 40.04,91.48 R32.P$1
D3
  Bottom 0.203: U$1.10 67.65,67.98 66.51,69.12 64.46,69.12 63.5,70.08 63.5,79.6 61.79,81.32 59.27,81.32 50.35,90.23 48.15,90.23 47.5,89.58 43.8,89.58 R31.P$1
D4
  Top 0.305: U$1.58 20.95,65.44 21.72,66.2 21.72,71.59 25.47,75.34 25.47,79.35 24.13,80.68 R35.P$1
D5
  Bottom 0.406: U$1.11 67.31,66.71 69.22,66.71 69.85,67.35 69.85,78.78 69.22,79.41 66.17,79.41 60.32,85.26 60.32,88.94 58.42,90.84 58.42,93.38 R28.P$1
D6
  Bottom 0.406: R29.P$1 59.69,90.72 61.23,89.18 61.23,85.5 66.41,80.31 69.46,80.31 70.49,79.29 70.49,66.71 69.22,65.44 U$1.12
D7
  Top 0.305: U$1.60 20.95,62.9 22.52,64.46 22.52,71.38 26.05,74.91 26.05,79.67 24.79,80.93 24.79,93.41 26.67,95.29 R34.P$1
D8
  Top 0.305: U$1.62 20.95,60.36 22.23,61.63 22.23,62.9 23.18,63.85 23.18,70.84 26.62,74.28 26.62,79.91 25.4,81.13 25.4,90.84 R33.P$1
D9  (via drill 0.38)
  Top 0.305: v55.24,62.27 54.59,62.93 54.59,69.23 59.69,74.33 59.69,79.41 62.23,81.95 v62.23,85.76
  Bottom 0.203: v55.24,62.27 55.88,61.63 56.71,61.63 57.09,61.25 59.94,61.25 60.25,61.56 63.57,61.56 64.13,61 65.41,61 U$1.15
  Bottom 0.305: R30.P$1 v62.23,85.76
D12  (via drill 0.38)
  Top 0.203: U$1.27 65.41,45.12 63.39,43.1 63.39,34.5 62.75,33.87 62.75,33.26 60.87,31.38 60.87,30.11 v61.82,29.16 62.08,28.91 62.08,6.86 S4.P$3 S4.P$4 59.97,3.89 57.47,6.39 57.47,12.1 R61.P$2
  Bottom 0.203: R15.P$2 R2.P$1 | R2.P$1 27.63,29.88 48.82,29.88 49.55,29.16 v61.82,29.16
  Bottom 0.61: R2.P$1
D13  (via drill 0.38)
  Top 0.203: U$1.28 67.31,46.39 65.3,46.39 62.91,44 62.91,34.7 62.27,34.07 62.27,33.41 v60.01,31.15 | v62.18,31.16 62.55,30.8 62.55,13.7 66.68,9.57 66.68,3.53 65.72,2.58 59.14,2.58 57.83,3.89 S3.P$3 S3.P$4 48.9,5.43 48.9,8.93 R60.P$2
  Bottom 0.203: R14.P$2 R4.P$1 26.04,37.56 32.77,30.83 49.6,30.83 49.86,31.09 56.26,31.09 56.87,30.48 57.75,30.48 58.42,31.15 v60.01,31.15 60.02,31.16 v62.18,31.16
D14  (via drill 0.38)
  Top 0.203: v37.15,49.57 v35.24,49.57 | v62.55,48.93 68.9,48.93 70.03,47.8 70.03,44.67 69.22,43.85 67.31,43.85 U$1.29 65.72,42.58 63.82,40.68 63.82,34.33 63.18,33.69 63.18,13.67 67.31,9.55 67.31,3.53 65.88,2.1 46.83,2.1 45.04,3.89 S2.P$3 S2.P$4 35.56,5.43 35.56,12.74 35.88,13.05 35.88,14.64 R59.P$2
  Bottom 0.203: R13.P$2 R6.P$1 26.67,49.57 v35.24,49.57 | v62.55,48.93 62.23,49.25 44.48,49.25 44.1,48.87 41.44,48.87 40.74,49.57 v37.15,49.57
D15
  Top 0.203: U$1.30 67.31,41.31 65.09,41.31 64.45,40.68 64.45,34.33 63.82,33.69 63.82,13.69 67.94,9.56 67.94,3.53 66.04,1.62 46.35,1.62 44.77,3.21 40.56,3.21 39.88,2.54 33.33,2.54 32.65,3.21 26.99,3.21 S1.P$3 | R9.P$1 26.04,57.5 24.77,56.23 24.77,30.52 24.13,29.88 23.5,29.88 22.23,28.61 22.23,10.19 22.54,9.87 22.54,7.66 S1.P$3 | S1.P$4 S1.P$3 | S1.P$3 26.31,5.39 R58.P$2
  Bottom 0.203: R11.P$2 R9.P$1
EURO_5V
  Top 0.406: J14.3 13.97,102.91 21.77,110.71 26.48,110.71 32.38,104.81 J13.5 J13.6
EURO_12V  (via drill 0.38, 0.4)
  Top 0.203: IC1.8 47.63,63.54 49.96,63.54 52.33,65.9 52.33,68.79 51.06,70.06 51.06,76.52 54.61,80.06 54.61,81.67 55.22,82.29 56.53,82.29 61.16,86.92 61.77,86.92 63.58,88.72 63.58,89.33 v63.82,89.57 | C15.2 v44.45,62.9
  Top 0.406: U1.IN 17.15,102.27 D1.C
  Bottom 0.203: v63.82,89.57 63.82,102.27 | v44.45,62.9 IC1.8
  Bottom 0.406: 29.84,103.54 29.84,101 R10.P$2 | 29.84,103.54 58.42,103.54 59.69,102.27 63.82,102.27 J13.7 J13.8 | 29.84,103.54 27.94,105.45 27.94,107.35 26.67,108.62 21.59,108.62 20.95,107.99 U1.IN
EURO_-12V
  Top 0.305: IC1.4 39.05,55.6 35.56,55.6 34.27,56.89 34.27,74.16 37.78,77.68 37.78,83.54 38.35,84.1 39.93,84.1 43.5,87.67 45.85,87.67 48.06,89.87 49.62,89.87 53.8,85.69 58.78,85.69 63.7,90.61 64.54,90.61 J13.15
  Top 0.406: J13.16 J13.15
  Bottom 0.203: IC1.4 C14.2
GND  (via drill 0.38, 0.4)
  Top 0.203: v21.91,52.74 v21.91,50.2 | v20.64,14.64 v20.64,12.42 | C16.1 44.59,42.05 44.86,42.32 44.86,44.4 45.36,44.89 v45.4,44.89 | v27.94,39.09 v27.94,40.99 | v42.23,49.57 v42.23,47.98 | C14.1 43.18,51.79 R54.P$1
  Top 0.254: 5.3 52.71,41.89 v52.71,42.9
  Top 0.305: U$1.89 U$1.91 | U$1.90 U$1.92 | 1.CHASSIS2 50.84,85.67 1.3 | ZENER.A 18.41,78.78 U$1.47 U$1.48 | 7.CHASSIS2 50.84,24.71 7.3 | v27.3,104.18 28.89,105.76 v29.53,105.76 | v22.86,97.19 v20.32,97.19
  Top 0.406: v31.12,31.47 v31.12,27.98 | v24.77,107.35 v24.77,109.89 | v72.39,76.87 v67.31,76.87
  Bottom 0.203: 4.3 30.52,38.81 30.48,38.77 27.94,38.77 v27.94,39.09 | v27.94,40.99 27.94,41.31 | 46.06,14.24 46.13,14.24 R60.P$1 | R54.P$1 42.23,49.88 v42.23,49.57
  Bottom 0.305: C10.2 19.07,95.94 v20.32,97.19
  Bottom 0.406: C17.1 C16.1 | 2.CHASSIS1 38.16,67.98 C13.1
  pour Bottom: 0,107.35 arc-90 4.45,111.8 81.91,111.8 arc-90 87,106.72 87,4.48 arc-90 82.55,0.04 4.45,0.04 arc-90 0,4.48
I2C_SCL
  Top 0.305: U$1.70 19.05,48.93 19.05,20.91 18.14,20 6.63,20 3.81,17.18 3.81,14.64 J15.3
I2C_SDA
  Top 0.305: J15.2 10.8,12.1 12.07,12.74 12.07,18.77 13.11,19.47 19.43,19.47 21.59,21.63 21.59,46.39 U$1.72
IN0
  Top 0.406: 0.2 33.12,80.57 33.12,66.2 29.2,62.28 29.2,57.89 30.48,56.61 30.48,47.57 34.52,43.53 35.98,43.53 36.18,43.74 36.84,43.74 37.31,43.27 37.31,42.97 37.32,42.96 37.32,38.28 U$1.IN_PIN1
IN1  (via drill 0.38)
  Top 0.305: v35.88,78.78 35.88,77.47 33.69,75.28 33.69,65.28 31.73,63.32 31.73,59.85 31.17,59.29 31.17,47.98 34.98,44.17 35.82,44.17 35.95,44.3 37.08,44.3 37.97,43.41 37.97,39.54 40.01,37.5 U$1.IN_PIN2
  Bottom 0.406: v35.88,78.78 36.87,79.77 36.87,82.63 38.03,83.79 50.22,83.79 1.2
IN2
  Top 0.305: 2.2 32.31,59.64 32.31,59.6 31.75,59.04 31.75,48.3 35.08,44.97 37.24,44.97 38.5,43.7 38.5,39.96 39.82,38.64 41.11,38.64 41.77,37.97 41.77,37.95 42.23,37.5 U$1.IN_PIN3
IN3
  Top 0.406: 3.2 52.07,59.08 52.07,54.65 53.34,53.38 53.34,44.8 49.86,41.32 49.86,40.88 48.88,39.9 48.4,39.42 46.48,37.5 U$1.IN_PIN4
IN4
  Bottom 0.406: U$1.IN_PIN5 46.99,38.77 37.45,38.77 36.93,38.25 34.11,38.25 33.51,38.85 33.51,39.54 4.2
IN5
  Top 0.406: 5.2 53.32,40.03 U$1.IN_PIN6
IN6  (via drill 0.38)
  Top 0.406: v33.02,34.33 6.2
  Bottom 0.406: U$1.IN_PIN7 52.15,36.31 35,36.31 v33.02,34.33
IN7
  Top 0.406: U$1.IN_PIN8 55.88,34.96 53.34,32.42 7.2
N$2
  Top 0.61: JACK_IN_6.P$1 13.89,47.58 J10.3
N$3
  Bottom 0.406: DZ1.6 R26.P$2
N$4
  Bottom 0.406: DZ1.7 R27.P$2
N$5
  Bottom 0.406: DZ1.8 R28.P$2
N$6
  Bottom 0.406: DZ1.9 R29.P$2
N$7
  Bottom 0.406: DZ1.10 R30.P$2
N$8
  Bottom 0.406: DZ1.5 R31.P$2
N$9
  Bottom 0.406: DZ1.4 R32.P$2
N$10
  Bottom 0.406: DZ1.3 R33.P$2
N$11
  Bottom 0.406: DZ1.2 R34.P$2
N$12
  Bottom 0.406: DZ1.1 R35.P$2
N$13
  Bottom 0.305: 55.86,80.69 1.1
  Bottom 0.406: R3.P$1 52.35,85.44 55.86,81.93 55.86,80.69
  Bottom 0.61: 1.1 55.84,78.18 C3.2
N$14  (via drill 0.38)
  Top 0.203: R23.P$2 50.4,33.18 v50.4,30.34
  Bottom 0.203: J12.2 8.26,22.26 12.68,26.69 12.68,27.84 15.86,31.02 21.76,31.02 22.95,29.83 26.57,29.83 27.08,30.34 v50.4,30.34
N$15
  Top 0.61: JACK_IN_7.P$1 13.89,36.15 J11.3
N$16
  Top 0.406: C7.2 33.82,18.01 6.1 35.4,19.83 35.4,32.8 R21.P$1
N$17
  Bottom 0.406: J9.2 8.72,55.92 10.2,57.39 13.76,57.39 17.15,54.01 R17.P$2
N$18
  Top 0.406: R19.P$1 55.84,52.07 5.1
  Top 0.61: 5.1 58.41,40.03 C6.2
N$19
  Top 0.61: JACK_IN_5.P$1 13.89,59.01 J9.3
N$20
  Top 0.61: JACK_IN_8.P$1 13.89,26.07 10.8,22.98 J12.3
N$21
  Top 0.305: 4.1 34.25,38.75 32.32,38.75 31.07,37.5 C5.2
  Bottom 0.203: 4.1 35.56,40.07 35.56,48.3 36.2,48.93 R17.P$1
N$22
  Bottom 0.406: J10.4 13.97,43.85 20.95,43.85 R13.P$1
N$23
  Bottom 0.305: J12.4 15.88,21.63 17.15,20.36 R15.P$1
N$24
  Bottom 0.406: J9.4 13.34,55.28 17.15,51.47 R11.P$1
N$25  (via drill 0.38)
  Top 0.305: R19.P$2 51.83,54.01 52.63,53.21 52.63,45.05 49.3,41.71 49.3,41.11 48.68,40.49 48.42,40.49 47.59,39.66 v47.27,39.66
  Bottom 0.254: J10.2 11.43,41.31 21.59,41.31 22.86,40.04 28.77,40.04 29.98,41.25 33.58,41.25 34.29,40.55 34.29,39.14 34.62,38.81 36.59,38.81 37.19,39.41 47.02,39.41 v47.27,39.66
N$26
  Bottom 0.305: J11.2 10.16,34.96 11.43,34.96 12.7,36.23 25,36.23 R21.P$2
N$27
  Bottom 0.406: J11.4 13.97,33.69 21.59,33.69 23.5,31.79 R14.P$1
N$29
  Top 0.305: R24.P$2 70.49,12.1 J22.1
N$30
  Top 0.61: J17.1 3.18,53.81 1.7,55.28 1.7,57.94 JACK_IN_5.P$2
N$31
  Bottom 0.406: JACK_OUT_1.P$1 72.47,101.72 R36.P$2
N$32
  Top 0.61: J19.1 3.18,30.88 1.66,32.4 1.66,35.04 JACK_IN_7.P$2
N$33
  Top 0.61: J18.1 3.18,42.4 1.69,43.89 1.69,46.5 JACK_IN_6.P$2
N$34
  Top 0.61: JACK_IN_8.P$2 5.39,26.05 1.59,22.25 1.59,21.02 3.18,19.43 J20.1
N$35
  Bottom 0.406: R37.P$2 72.47,90.29 JACK_OUT_2.P$1
N$36
  Top 0.305: R38.P$2 78.19,78.78 76.06,80.9 73.34,80.9 72.61,81.63 72.61,84.35 JACK_OUT_3.P$1
N$37
  Bottom 0.305: JACK_OUT_4.P$1 72.39,72.98 R39.P$2
N$38
  Top 0.305: JACK_OUT_5.P$1 72.39,61.55 R40.P$2
N$39
  Top 0.305: JACK_OUT_6.P$1 72.39,50.12 R41.P$2
N$40
  Top 0.305: JACK_OUT_7.P$1 72.39,38.69 R42.P$2
N$41
  Top 0.406: JACK_OUT_8.P$1 72.47,25.44 76.28,21.63 R43.P$2
N$42
  Top 0.203: R44.P$2 45.72,78.78 45.72,76.59 45.09,75.95 45.09,70.67 46.5,69.25 48.8,69.25 48.84,69.21 49.61,69.21 50.7,68.12 50.7,66.57 49.61,65.48 48.07,65.48 46.68,66.87 44.94,66.87 44.92,66.85 43.96,66.85 43.18,66.08 43.18,62.58 39.37,58.77 IC1.3
N$43  (via drill 0.4)
  Top 0.203: v37.83,75.79 37.83,75.23 38.1,74.97 38.1,73.24 37.47,72.61 37.47,71.91 35.24,69.69 35.24,64.49 IC1.2
  Bottom 0.203: v37.83,75.79 38.18,76.14 43.59,76.14 R45.P$2 45.72,71.47 45.72,68.6 C11.1
N$44  (via drill 0.38)
  Top 0.203: R49.P$2 47.85,69.66 48.97,69.66 49.01,69.62 49.78,69.62 51.11,68.29 51.11,66.41 49.78,65.08 47.9,65.08 47.51,65.47 46.33,65.47 C11.2
  Top 0.305: v60.32,52.11 61.28,51.15 61.28,47.98 62.23,47.03 62.23,34.96 59.05,31.79 59.05,29.25 61.51,26.8 61.51,19.01 60.94,18.44 60.94,17.63 58.27,14.96 R25.P$1
  Bottom 0.203: v60.32,52.11 49.34,52.11 48.43,53.02 48.43,53.85 48.72,54.14 48.72,60.54 47.32,61.94 46.59,61.94 46.33,62.19 44.16,62.19 43.45,62.9 IC1.1 40.64,64.17 45.03,64.17 C11.2
N$45  (via drill 0.38)
  Top 0.203: IC1.6 44.45,55.28 C18.1 44.45,51.9 44.83,51.52 44.83,50.14 45.09,49.88 v45.09,48.3 | R51.P$2 30.52,35.55 29.21,36.87 29.21,40.99 31.12,42.9 36.47,42.9 v36.51,42.94
  Bottom 0.203: v36.51,42.94 40.6,47.03 43.82,47.03 v45.09,48.3
N$46
  Top 0.203: R47.P$2 R45.P$1 R49.P$1 39.05,70.2 38.06,69.21 36.75,69.21 35.66,68.12 35.66,65.98 36.51,65.12 39.69,65.12 C13.2
N$47
  Top 0.203: R46.P$2 R44.P$1 R48.P$2 39.37,77.51 39.37,76.66 43.04,72.99 43.04,67.51 41.91,66.38 C12.2
N$48
  Bottom 0.203: C16.2 47.13,42.15 R52.P$2 46.07,43.22 R54.P$2 R50.P$1
N$50  (via drill 0.4)
  Top 0.203: R55.P$2 59.71,35.26 59.71,51.13 v59.69,51.15
  Bottom 0.203: v59.69,51.15 48.9,51.15 C18.2 48.26,54.33 48.26,59.09 IC1.7
  Bottom 0.254: R55.P$2 64.77,30.2 64.77,21.31 65.93,20.15 66.88,20.15 67.3,19.73 R56.P$1
N$51
  Top 0.305: R57.P$2 64.31,15.77 64.31,13.9 69.6,8.61 78.42,8.61 J21.1
N$52  (via drill 0.38)
  Top 0.203: v36.51,41.95 36.51,41.12 36.65,40.98 36.65,36.46 R51.P$1
  Bottom 0.203: R55.P$1 R53.P$2 42.4,34.96 41.16,33.72 39.39,33.72 R51.P$1 | C17.2 38.88,41.95 v36.51,41.95
N$54
  Bottom 0.203: IC1.5 44.77,55.28 43.04,53.55 43.04,52.59 42.38,51.93 41.41,51.93 R50.P$2
OUT0  (via drill 0.38)
  Top 0.305: v71.12,57.82 69.85,56.55 64.77,56.55 63.5,55.28 U$1.OUT_PIN1
  Bottom 0.305: v71.12,57.82 71.75,58.46 80.65,58.46 82.55,60.36 82.55,100.37 81.28,101.64 R36.P$1
OUT1
  Bottom 0.406: R37.P$1 78.74,88.94 76.84,88.94 74.93,87.03 74.93,61.63 72.39,59.09 64.6,59.09 64.46,58.95 63.81,58.95 63.67,59.09 62.28,59.09 61.56,58.37 61.51,58.37 U$1.OUT_PIN2
OUT2
  Top 0.406: U$1.OUT_PIN3 62.87,62.27 62.87,77.98 64.3,79.41 71.75,79.41 R38.P$1
OUT3  (via drill 0.38)
  Top 0.406: R39.P$1 77.3,64.63 74.59,64.63 74.12,64.17 v64.13,64.17
  Bottom 0.406: v64.13,64.17 62.23,64.17 U$1.OUT_PIN4
OUT4  (via drill 0.38)
  Top 0.406: v73.66,62.9 74.29,62.27 74.29,58.46 76.84,55.92 R40.P$1
  Bottom 0.406: U$1.OUT_PIN5 64.12,65.44 65.39,64.17 72.39,64.17 v73.66,62.9
OUT5
  Top 0.406: R41.P$1 78.57,45.93 75.22,45.93 73.83,47.32 73.83,50.66 70.49,54.01 60.56,54.01 59.68,54.9 59.68,65.84 60.96,67.12 U$1.OUT_PIN6
OUT6
  Top 0.406: U$1.OUT_PIN7 62.23,71.79 62.23,78.46 63.82,80.05 71.79,80.05 72.01,80.27 75.87,80.27 80.07,76.06 80.35,76.06 82.6,73.82 82.6,34.91 80.75,33.06 R42.P$1
OUT7
  Top 0.406: U$1.OUT_PIN8 59.69,73.06 55.24,68.62 55.24,64.17 57.15,62.27 57.15,56.55 62.23,51.47 69.85,51.47 70.65,50.67 70.65,44.29 70.49,44.12 70.49,23.53 R43.P$1
POT_IN1
  Bottom 0.305: R12.P$1 30.48,77.19 C4.2
  Bottom 0.406: R12.P$1 31.76,81.32 32.38,81.95 34.23,81.95 0.1
POT_IN3
  Top 0.305: R1.P$1 36.83,71.98 34.78,69.94 34.78,61.08 2.1
  Bottom 0.61: 2.1 35.56,60.31 C2.2
POT_IN4
  Top 0.61: C1.2 55.88,60.31 3.1 53.3,62.89 53.3,70.48 R5.P$1
POT_IN8
  Top 0.406: R23.P$1 55.84,31.03 7.1 55.85,19.72 C8.2
REG_5V
  Bottom 0.406: U1.OUT 26.04,105.45 24.77,104.18 | 24.77,104.18 11.43,104.18 J14.1 | 24.77,104.18 24.13,103.54 D1.A | C10.1 18.41,99.06 19.05,99.7 19.05,99.88 21.45,102.27 D1.A | D1.A C9.2
VOLTAGE_SELECT_OUTPUT
  Bottom 0.61: JACK_IN_1.P$2 JACK_IN_2.P$2 5.39,95.83 11.01,90.21 J16.2 10.97,90.21 5.39,84.63 JACK_IN_3.P$2 JACK_IN_4.P$2 5.39,63.62 3.91,62.13 3.91,57.72 J9.1 | J9.1 5.71,52.59 4.02,50.9 4.02,49.39 5.71,47.7 J10.1 | J10.1 5.71,41.18 3.95,39.42 3.95,38.05 5.71,36.28 J11.1 | J11.1 5.71,29.72 4.01,28.02 4.01,26.57 5.71,24.87 J12.1 J20.2 | J17.2 J9.1 | J18.2 J10.1 | J19.2 J11.1
ZENER_10V
  Top 0.406: ZENER.C 17.15,93.38 J16.3
  Bottom 0.406: R10.P$1 21.59,95.92 19.05,93.38 ZENER.C

### Text on the board
tPlace: PEPPER-REV2 / BELA.IO / (c) 2020 | OUT | IN
tNames: 0 | 0 | 1 | 1 | 2 | 2 | 3 | 3 | 4 | 4 | 5 | 5 | 6 | 6 | 7 | 7 | L | L | R | R | FRONT
bNames: 12V IN | GND | 5V OUT | +5V | 12V with regulator | +12V | GND | 5V straight from rack | GND | GND | 3V3 to pots | -12V | red | stripe | 10V to pots from rack | digital | IN4 | analog | analog | digital | IN5 | analog | analog | digital | IN6 | analog | analog | digital | IN7 | analog | analog | 3V3 | SCL | SDA | GND | Bela audio out | Amplified audio w/ rack 12V | BACK | 3V3 | SCL | SDA | GND